# EAGLE design Adafruit_AS7341 (EAGLE 9.6.2)
COMPANY: ADAFRUIT INDUSTRIES; DRAWN: KTOWN; REV: A
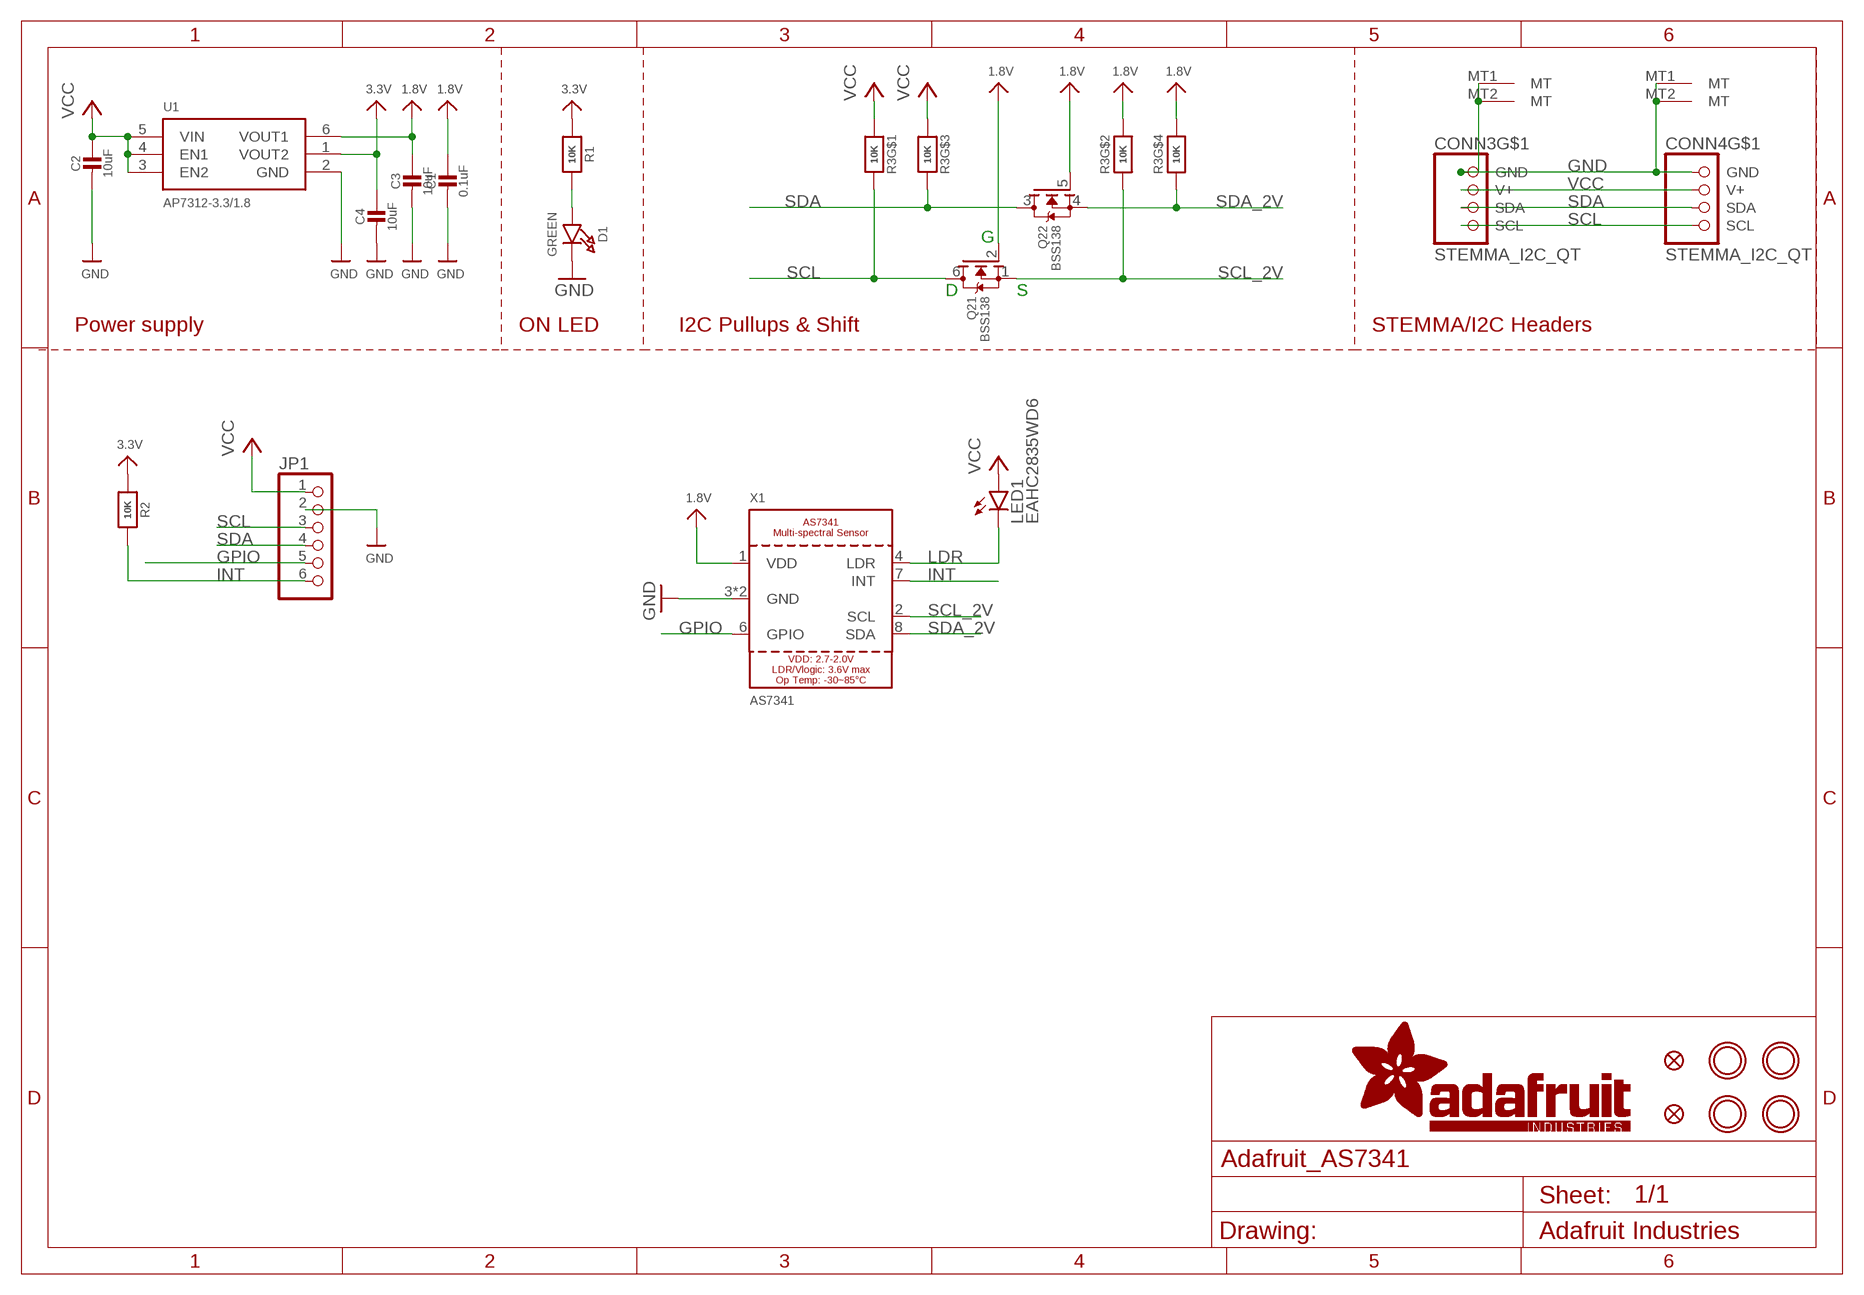
[diagram p0: schematic, sheet 1]

## Parts
C1  0.1uF  CAP_CERAMIC0603_NO  [0603-NO]
C2  10uF  CAP_CERAMIC0805-NOOUTLINE  [0805-NO]
C3  10uF  CAP_CERAMIC0805-NOOUTLINE  [0805-NO]
C4  10uF  CAP_CERAMIC0805-NOOUTLINE  [0805-NO]
CONN3  STEMMA_I2C_QT  [JST_SH4]
CONN4  STEMMA_I2C_QT  [JST_SH4]
D1  GREEN  LED0603_NOOUTLINE  [CHIPLED_0603_NOOUTLINE]
FID3  FIDUCIAL_1MM  [FIDUCIAL_1MM]
FID4  FIDUCIAL_1MM  [FIDUCIAL_1MM]
JP1  HEADER-1X670MIL  [1X06_ROUND_70]
LED1  EAHC2835WD6  LEDKA-3528ASYC  [KA-3528ASYC]
Q2  BSS138  MOSFET-N_DUAL  [SOT363]
R1  10K  RESISTOR_0603_NOOUT  [0603-NO]
R2  10K  RESISTOR_0603_NOOUT  [0603-NO]
R3  10K  RESISTOR_4PACK  [RESPACK_4X0603]
U1  AP7312-3.3/1.8  VREG_SOT23-6_DUALAP7312  [SOT23-6]
U$1  MOUNTINGHOLE2.5  [MOUNTINGHOLE_2.5_PLATED]
U$17  MOUNTINGHOLE2.5  [MOUNTINGHOLE_2.5_PLATED]
U$19  MOUNTINGHOLE2.5  [MOUNTINGHOLE_2.5_PLATED]
U$21  MOUNTINGHOLE2.5  [MOUNTINGHOLE_2.5_PLATED]
X1  AS7341  [AS7341]

## Nets
1.8V [lowpower]: C1.1 C3.1 Q2.2(1:G) Q2.5(2:G) R3.2 R3.4 U1.6(VOUT1) X1.1(VDD)
3.3V: C4.1 R1.1 R2.1 U1.1(VOUT2)
GND [highpower]: C1.2 C2.2 C3.2 C4.2 CONN3.1(GND) CONN3.MT1(MT) CONN3.MT2(MT) CONN4.1(GND) CONN4.MT1(MT) CONN4.MT2(MT) D1.C JP1.2 U1.2(GND) X1.3(GND) X1.5(GND)
GPIO: JP1.5 X1.6(GPIO)
INT: JP1.6 R2.2 X1.7(INT)
LDR: LED1.C X1.4(LDR)
N$1: D1.A R1.2
SCL: CONN3.4(SCL) CONN4.4(SCL) JP1.3 Q2.6(1:D) R3.8
SCL_2V: Q2.1(1:S) R3.7 X1.2(SCL)
SDA: CONN3.3(SDA) CONN4.3(SDA) JP1.4 Q2.3(2:D) R3.6
SDA_2V: Q2.4(2:S) R3.5 X1.8(SDA)
VCC [highpower]: C2.1 CONN3.2(V+) CONN4.2(V+) JP1.1 LED1.A R3.1 R3.3 U1.3(EN2) U1.4(EN1) U1.5(VIN)

## Notes on the sheet
- G
- D | S
- Power supply | ON LED | I2C Pullups & Shift | STEMMA/I2C Headers

## Library data of the parts
C1-C4 = microbuilder:CAP_CERAMIC: Ceramic Capacitors For new designs, use the packages preceded by an '_' character since they are more reliable: The following footprints should be used on most boards: _0402 - Standard footprint for regular board layouts _0603 - Standard footprint for regular board layouts _0805 - Standard footprint for regular board layouts _1206 - Standard footprint for regular board layouts For extremely tight-pitch boards where space is at a premium, the following 'micro-pitch' footprints can be used (smaller pads, no silkscreen outline, etc.): _0402MP - Micro-pitch footprint for very dense/compact boards _0603MP - Micro-pitch footprint for very dense/compact boards _0805MP - Micro-pitch footprint for very dense/compact boards _1206MP - Micro-pitch footprint for very dense/compact boards
CONN3 CONN4 = microbuilder:STEMMA_I2C
D1 = microbuilder:LED: LED
FID3 FID4 = microbuilder:FIDUCIAL: Fiducial Alignment Points Various fiducial points for machine vision alignment.; BOM: EXCLUDE
JP1 = microbuilder:HEADER-1X6: PIN HEADER
LED1 = led:LED: LED
Q2 = microbuilder:MOSFET-N_DUAL: Dual N-Channel MOSFET SOT363 (2.0x1.25mm) 2N7002PS - 60V, 320mA [Digikey: 568-5984-1-ND]
R1 R2 = microbuilder:RESISTOR: Resistors For new designs, use the packages preceded by an '_' character since they are more reliable: The following footprints should be used on most boards: _0402 - Standard footprint for regular board layouts _0603 - Standard footprint for regular board layouts _0805 - Standard footprint for regular board layouts _1206 - Standard footprint for regular board layouts For extremely tight-pitch boards where space is at a premium, the following 'micro-pitch' footprints can be used (smaller pads, no silkscreen outline, etc.): _0402MP - Micro-pitch footprint for very dense/compact boards _0603MP - Micro-pitch footprint for very dense/compact boards _0805MP - Micro-pitch footprint for very dense/compact boards _1206MP - Micro-pitch footprint for very dense/compact boards
R3 = microbuilder:RESISTOR_4PACK: Resistor Packs (4 resistors) 4 x 0603 10K 1/16W - Digikey: YC164J-10KCT-ND
U1 = adafruit_power:VREG_SOT23-6_DUAL: Dual Output SOT23-6 Linear Regulators Diodes Inc. AP7312 - Dual 150mA LDO Linear Regulator 0.2V dropout, 150mA output, 2-6V Input AP7312-1833W6-7 - 1.8V/3.3V SOT23-6 (Digikey: AP7312-1833W6-7DICT-ND) MIC5320 - Dual 150mA ULDO Linear Regulator Ultra-low 35mV dropout at 150mA, 2.3-5.5V Input 3.3V/1.8V SOT23-6 (Digikey: 576-1658-1-ND) 3.3V/1.5V SOT23-6 (Digikey: 576-3483-1-ND)
U$1 U$17 U$19 U$21 = microbuilder:MOUNTINGHOLE: Mounting Hole For #2 screws (0.086"/2.18mm width, 0.094"/2.4mm hole) use 2.5mm; BOM: EXCLUDE
X1 = adafruit_sensor:AS7341

## Net classes
1 highpower: width 0.305 mm, drill 0.483 mm
2 lowpower: width 0.254 mm, drill 0.483 mm

## Board
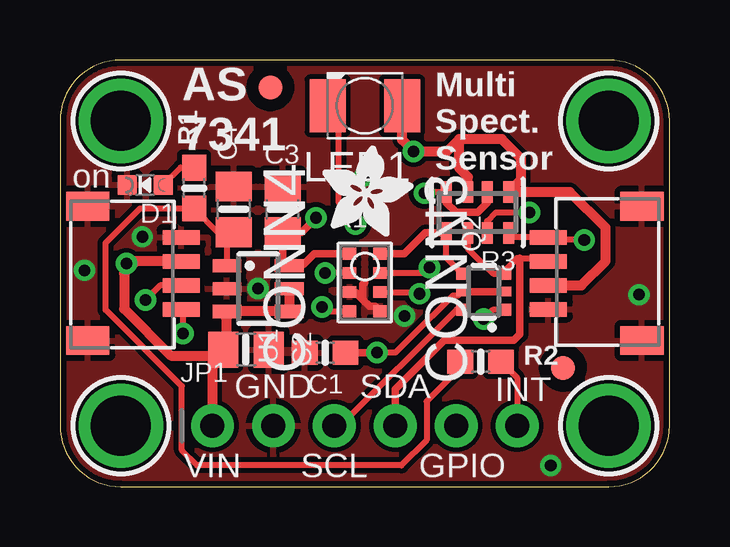
[diagram p1: board, top side]
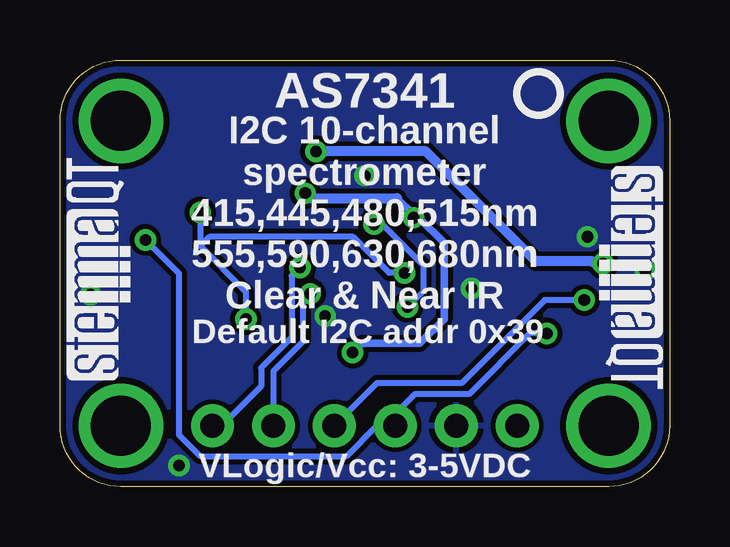
[diagram p2: board, bottom side, seen from below]

Size 25.4 x 17.78 mm. Coordinates in mm from the lower left corner, seen from the top.
Outline: 0,15.24 0,2.54 arc90 2.54,0 22.86,0 arc90 25.4,2.54 25.4,15.24 arc90 22.86,17.78 2.54,17.78 arc90 0,15.24
Copper layers (1*16): Top 0.035mm / dielectric 1.5mm / Bottom 0.035mm
Design rules "adafruit *": minimum track width 8mil, minimum drill 15.5mil, track to track 8mil, track to pad 8mil, pad to pad 8mil, via to via 8mil, smd to smd 8mil, copper to edge 10mil, drill to drill 8mil, minimum pad ring 10mil, minimum via ring 8mil, stop-mask expansion 2mil, vias tented up to drill 20mil, thermal gap 10mil

### Footprints (pad centres in the part's own frame; a part is rotated, then mirrored left to right if it is on the bottom)
0603-NO = smd 1.075 x 1: 1 -0.85,0; 2 0.85,0
0805-NO = smd 1.24 x 1.5: 1 -0.95,0; 2 0.95,0
JST_SH4 = smd 0.6 x 1.55: 1 -1.5,2.514; 2 -0.5,2.514; 3 0.5,2.514; 4 1.5,2.514 | smd 1.2 x 1.8: MT1 -2.8,-1.386; MT2 2.8,-1.386
CHIPLED_0603_NOOUTLINE = smd 0.8 x 0.8: A 0,-0.75; C 0,0.75
FIDUCIAL_1MM = smd 1 x 1: 1 0,0
1X06_ROUND_70 = drill 1 pad 1.778: 1 -6.35,0; 2 -3.81,0; 3 -1.27,0; 4 1.27,0; 5 3.81,0; 6 6.35,0
KA-3528ASYC = smd 1.5 x 2.2: A -1.55,0; C 1.55,0
SOT363 = smd 0.5 x 0.5: 1 -0.75,-0.9; 3 0.75,-0.9; 4 0.75,0.9; 6 -0.75,0.9 | smd 0.4 x 0.5: 2 0,-0.9; 5 0,0.9
RESPACK_4X0603 = smd 0.45 x 0.9: 1 -1.3,-0.85; 2 -0.4,-0.85; 3 0.4,-0.85; 4 1.3,-0.85; 5 1.3,0.85; 6 0.4,0.85; 7 -0.4,0.85; 8 -1.3,0.85
SOT23-6 = smd 0.55 x 1.2: 1 -0.95,-1.3; 2 0,-1.3; 3 0.95,-1.3; 4 0.95,1.3; 5 0,1.3; 6 -0.95,1.3
MOUNTINGHOLE_2.5_PLATED = drill 2.5 pad 3.2: P$1 0,0
AS7341 = smd 0.575 x 0.488: 1 -0.635,1.2; 2 -0.635,0.4; 3 -0.635,-0.4; 4 -0.635,-1.2; 5 0.635,-1.2; 6 0.635,-0.4; 7 0.635,0.4; 8 0.635,1.2

### Placement (x,y rotation side)
C1  11.05,5.59 180 top
C2  7.75,5.71 0 top
C3  9.27,11.56 90 top
C4  7.24,11.56 90 top
CONN3  22.86,8.89 90 top
CONN4  2.54,8.89 270 top
D1  3.56,12.57 90 top
FID3  20.95,4.95 0 top
FID4  8.76,16.64 0 top
JP1  12.7,2.54 0 top
LED1  12.7,15.88 180 top
Q2  17.65,8.13 90 top
R1  5.59,12.45 90 top
R2  17.53,5.21 0 top
R3  17.4,11.43 180 top
U1  8.26,8.26 270 top
U$1  2.54,15.24 0 top
U$17  22.86,15.24 0 top
U$19  2.54,2.54 0 top
U$21  22.86,2.54 0 top
U$22  [ADAFRUIT_3.5MM]  10.92,10.41 0 top
U$25  [PCBFEAT-REV-040]  5.46,16.38 0 bottom
U$30  [STEMMAQT]  22.48,4.45 90 bottom
U$31  [STEMMAQT]  2.92,13.34 270 bottom
X1  12.7,8.51 0 top

### Tracks (layer width: path | path; a pad name or v marks a point on that pad's centre or on a via)
1.8V  (via drill 0.48)
  Top 0.254: Q2.5 16.58,7.96 16.37,7.96 15.52,7.11 15.49,7.11 13.97,5.59 v13.21,5.59 | R3.4 15.23,12.28 v15.18,12.23 | U1.6 9.62,9.27 9.65,9.27
  Top 0.305: U1.6 9.27,9.49 C3.1 10.07,10.61 v10.67,11.21 | Q2.2 Q2.5 | R3.2 17.8,11.83 17.4,11.43 16.51,11.43 16.1,11.84 R3.4 | C1.1 v13.21,5.59 | X1.1 10.6,9.71 10.16,9.27 9.65,9.27
  Bottom 0.305: v13.21,5.59 12.83,5.97 10.41,5.97 9.4,6.99 9.4,10.16 10.44,11.21 v10.67,11.21 10.67,11.33 11.36,12.03
  Bottom 0.406: 11.36,12.03 14.98,12.03 v15.18,12.23
3.3V
  Top 0.254: U1.1 6.96,10.32 C4.1 6.58,10.61 R1.1 3.34,11.6 1.91,10.16 1.91,7.37 5.08,4.19 5.08,1.52 5.71,0.89 14.22,0.89 15.28,1.94 15.28,3.56 16.68,4.95 R2.1
GND  (via drill 0.48)
  Top 0.305: X1.5 13.13,7.51 12.9,7.51 12.62,7.79 | X1.3 12.3,8.11 12.62,7.79 | 12.62,7.79 12.62,8.43 12.7,8.51
  other vias: 12.7,12.95 3.43,10.41 8.26,8.26 24.13,8 1.02,9.02 14.35,7.11 20.45,0.89
  pour Top: 0,17.78 25.4,17.78 25.4,0 0,0
  pour Bottom: 0,17.78 25.4,17.78 25.4,0 0,0
GPIO  (via drill 0.48)
  Top 0.254: X1.6 14.9,8.11 v14.97,8.04
  Bottom 0.254: v14.97,8.04 15.29,7.72 15.29,6.03 16.51,4.81 JP1.5
INT  (via drill 0.48)
  Top 0.254: X1.7 15.18,8.91 v15.4,9.13 | R2.2 19.05,4.53 JP1.6
  Bottom 0.254: v15.4,9.13 15.75,8.79 15.75,6.22 17.02,4.95 17.02,4.19 18.67,2.54 JP1.6
LDR  (via drill 0.48)
  Top 0.254: v12.32,10.94 12.32,11.15 11.61,11.86 11.61,15.42 LED1.C | v10.92,7.49 11.11,7.31 X1.4
  Bottom 0.254: v12.32,10.94 11.98,10.94 10.27,9.23 10.27,8.14 v10.92,7.49
N$1
  Top 0.254: D1.A 5.03,13.3 R1.2
SCL  (via drill 0.48)
  Top 0.254: CONN4.4 5.12,7.33 v5.12,6.39 | JP1.3 11.68,2.54 16.52,7.38 Q2.6 | R3.8 18.89,10.39 CONN3.4 20.45,10.29 v21.84,10.29
  Bottom 0.254: v5.12,6.39 5.82,6.39 8.35,3.86 10.62,3.86 11.43,3.05 JP1.3 12.19,2.54 13.46,1.27 19.56,1.27 20.45,2.16 20.45,8.89 v21.84,10.29
SCL_2V  (via drill 0.48)
  Top 0.254: Q2.1 18.43,7.38 18.41,7.37 18.03,7.37 v17.65,6.99 | R3.7 17.8,11.07 18.16,11.43 v19.56,11.43 | X1.2 | X1.2 v11.05,8.91
  Bottom 0.254: v19.56,11.43 19.56,10.03 | 19.56,10.03 17.65,8.13 v17.65,6.99 | v11.05,8.91 11.68,8.91 13.19,10.41 19.18,10.41 19.56,10.03
SDA  (via drill 0.48)
  Top 0.254: R3.6 17,9.92 18.05,8.88 Q2.3 18.55,9.03 19.05,9.53 19.16,9.53 20.21,9.53 CONN3.3 | CONN4.3 4.17,8.39 v3.56,7.78
  Top 0.305: 19.16,9.53 19.16,6.35 18.91,6.1 16,6.1 13.97,4.06 JP1.4
  Bottom 0.254: v3.56,7.78 5.21,7.78 8.67,4.32 12.19,4.32 JP1.4
SDA_2V
  Top 0.254: Q2.4 16.1,9.53 R3.5
  Top 0.305: X1.8 14.35,9.71 15.22,10.58 R3.5
VCC  (via drill 0.48)
  Top 0.406: U1.5 U1.4 U1.3 6.96,7.05 6.92,7.02 6.92,5.84 C2.1 | CONN4.2 3.17,9.39 | 3.17,9.39 2.67,8.89 2.67,7.41 4.62,5.46 6.54,5.46 C2.1 | C2.1 6.35,5.27 JP1.1 | 16.62,14.35 16.51,14.35 16.13,13.97 v14.73,13.97 14.25,14.45 LED1.A | 16.62,14.35 16.62,14.48 18.41,14.48 19.21,13.69 19.21,12.79 R3.1 21.25,12.28 22.73,10.79 22.73,9.4 21.73,8.39 CONN3.2 | 16.62,14.35 16.62,13.3 17,12.91 R3.3 | 3.17,9.39 2.86,9.39 v2.77,9.3
  Bottom 0.406: v2.77,9.3 3.11,9.3 3.2,9.39 5.58,9.39 10.16,13.97 v14.73,13.97

### Text on the board
tPlace: AS / 7341 | Multi / Spect. / Sensor | on | GND | SDA | INT | VIN | SCL | GPIO
bPlace: AS7341 | I2C 10-channel / spectrometer / 415,445,480,515nm / 555,590,630,680nm / Clear & Near IR | Default I2C addr 0x39 | VLogic/Vcc: 3-5VDC